# Altium schematic sheet STM32F103RBT6.SchDoc
size A4
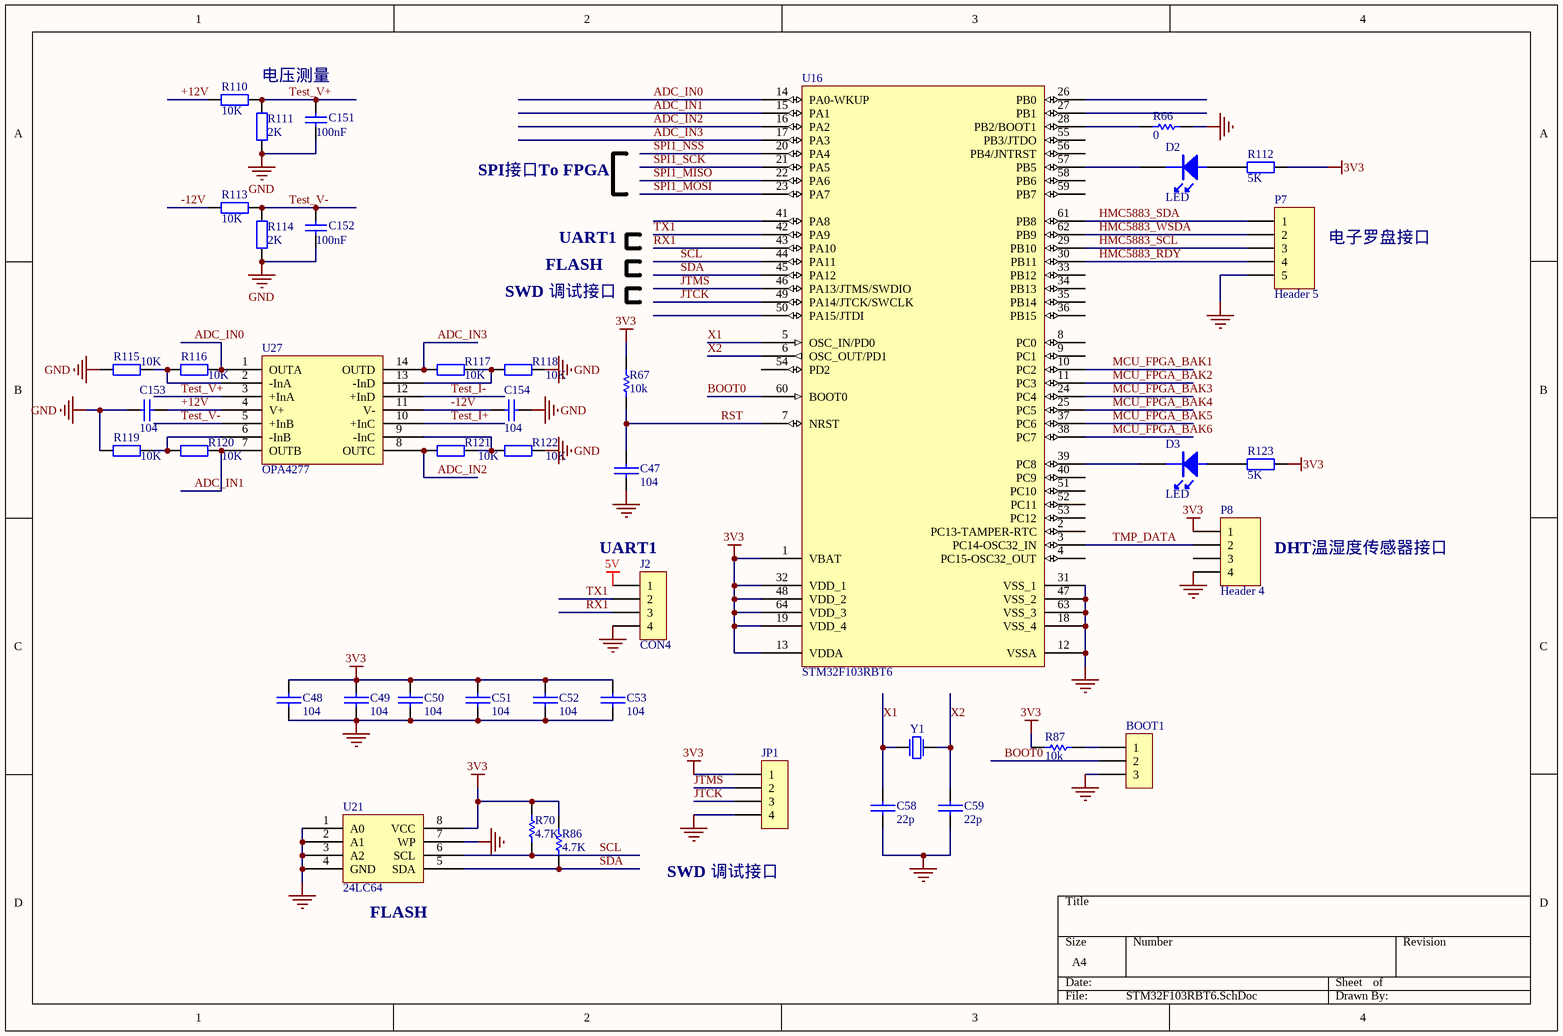
[diagram p0: STM32F103RBT6.SchDoc]

## Parts
BOOT1  (no value)  [HDR1X3]
C47  104  [0603]
C48  104  [0603]
C49  104  [0603]
C50  104  [0603]
C51  104  [0603]
C52  104  [0603]
C53  104  [0603]
C58  22p  [0603]
C59  22p  [0603]
C151  value 100nF  [0603]  (hidden comment: Cap)
C152  value 100nF  [0603]  (hidden comment: Cap)
C153  104  [0603]
C154  104  [0603]
D2  LED  [0805_LED]
D3  LED  [0805_LED]
J2  CON4  [HDR1X4]
JP1  (no value)  [HDR1X4]
P7  Header 5  [HDR1X5]
P8  Header 4  [HDR1X4]
R66  0  [0603]
R67  10k  [0603]
R70  4.7K  [0603]
R86  4.7K  [0603]
R87  10k  [0603]
R110  value 10K  [0603]  (hidden comment: Res2)
R111  value 2K  [0603]  (hidden comment: Res2)
R112  value 5K  [0603]  (hidden comment: Res2)
R113  value 10K  [0603]  (hidden comment: Res2)
R114  value 2K  [0603]  (hidden comment: Res2)
R115  value 10K  [0603]  (hidden comment: Res2)
R116  value 10K  [0603]  (hidden comment: Res2)
R117  value 10K  [0603]  (hidden comment: Res2)
R118  value 10K  [0603]  (hidden comment: Res2)
R119  value 10K  [0603]  (hidden comment: Res2)
R120  value 10K  [0603]  (hidden comment: Res2)
R121  value 10K  [0603]  (hidden comment: Res2)
R122  value 10K  [0603]  (hidden comment: Res2)
R123  value 5K  [0603]  (hidden comment: Res2)
U16  STM32F103RBT6  [LQFP64_M]
U21  24LC64  [SO8]
U27  OPA4277  [SOP14]
Y1  (no value)  [XTAL_8M]

## Nets
3V3: C48.1 C49.1 C50.1 C51.1 C52.1 C53.1 JP1.1 P8.1 R67.2 R70.2 R86.2 R87.1 R112.2 R123.2 U16.1(VBAT) U16.13(VDDA) U16.19(VDD_4) U16.32(VDD_1) U16.48(VDD_2) U16.64(VDD_3) U21.8(VCC)
5V: J2.1
GND: BOOT1.3 C47.2 C48.2 C49.2 C50.2 C51.2 C52.2 C53.2 C58.2 C59.2 C151.1 C152.1 C153.1 C154.2 J2.4 JP1.4 P7.5 P8.4 R66.2 R111.2 R114.2 R115.1 R118.2 R119.1 R122.2 U16.12(VSSA) U16.18(VSS_4) U16.31(VSS_1) U16.47(VSS_2) U16.63(VSS_3) U21.1(A0) U21.2(A1) U21.3(A2) U21.4(GND) U21.7(WP)
+12V: C153.2 R110.2 U27.4(V+)
-12V: C154.1 R113.2 U27.11(V-)
ADC_IN0: R116.2 U16.14(PA0-WKUP) U27.1(OUTA)
ADC_IN1: R120.2 U16.15(PA1) U27.7(OUTB)
ADC_IN2: R121.1 U16.16(PA2) U27.8(OUTC)
ADC_IN3: R117.1 U16.17(PA3) U27.14(OUTD)
BOOT0: BOOT1.2 U16.60(BOOT0)
HMC5883_RDY: P7.4 U16.30(PB11)
HMC5883_SCL: P7.3 U16.29(PB10)
HMC5883_SDA: P7.1 U16.61(PB8)
HMC5883_WSDA: P7.2 U16.62(PB9)
JTCK: JP1.3 U16.49(PA14/JTCK/SWCLK)
JTMS: JP1.2 U16.46(PA13/JTMS/SWDIO)
MCU_FPGA_BAK1: U16.10(PC2)
MCU_FPGA_BAK2: U16.11(PC3)
MCU_FPGA_BAK3: U16.24(PC4)
MCU_FPGA_BAK4: U16.25(PC5)
MCU_FPGA_BAK5: U16.37(PC6)
MCU_FPGA_BAK6: U16.38(PC7)
RST: C47.1 R67.1 U16.7(NRST)
RX1: J2.3 U16.43(PA10)
SCL: R70.1 U16.44(PA11) U21.6(SCL)
SDA: R86.1 U16.45(PA12) U21.5(SDA)
SPI1_MISO: U16.22(PA6)
SPI1_MOSI: U16.23(PA7)
SPI1_NSS: U16.20(PA4)
SPI1_SCK: U16.21(PA5)
Test_I+: U27.10(+InC)
Test_I-: U27.12(+InD)
Test_V+: C151.2 R110.1 R111.1 U27.3(+InA)
Test_V-: C152.2 R113.1 R114.1 U27.5(+InB)
TMP_DATA: P8.2 U16.3(PC14-OSC32_IN)
TX1: J2.2 U16.42(PA9)
X1: C58.1 U16.5(OSC_IN/PD0) Y1.2(P2)
X2: C59.1 U16.6(OSC_OUT/PD1) Y1.1(P1)
NetBOOT1_1: BOOT1.1 R87.2
NetD2_1: D2.1(A) R112.1
NetD2_2: D2.2(K) U16.57(PB5)
NetD3_1: D3.1(A) R123.1
NetD3_2: D3.2(K) U16.39(PC8)
NetR66_1: R66.1 U16.28(PB2/BOOT1)
NetR115_2: R115.2 R116.1 U27.2(-InA)
NetR117_2: R117.2 R118.1 U27.13(-InD)
NetR119_2: R119.2 R120.1 U27.6(-InB)
NetR121_2: R121.2 R122.1 U27.9(-InC)

Not connected (* = marked no-connect by the designer): P8 3; U16 2(PC13-TAMPER-RTC) 4(PC15-OSC32_OUT) 8(PC0) 9(PC1) 26(PB0) 27(PB1) 33(PB12) 34(PB13) 35(PB14) 36(PB15) 40(PC9) 41(PA8) 50(PA15/JTDI) 51(PC10) 52(PC11) 53(PC12) 54(PD2) 55(PB3/JTDO) 56(PB4/JNTRST) 58(PB6) 59(PB7)

## Notes on the sheet
- 电压测量
- SPI接口To FPGA
- UART1
- 电子罗盘接口
- SWD 调试接口
- FLASH
- (near J2) UART1
- DHT温湿度传感器接口
- (near U21) FLASH

## Library data of the parts
BOOT1 = CON3: Connector
C47-C53 C58 C59 = CAP: Capacitor
C151 C152 = Cap: Capacitor; Published: 8-Jun-2000; LatestRevisionDate: 17-Jul-2002; LatestRevisionNote: Re-released for DXP Platform.; PackageReference: RAD-0.3; Publisher: Altium Limited
C153 C154 = Cap: Capacitor; Value: 100nF; Published: 8-Jun-2000; LatestRevisionDate: 17-Jul-2002; LatestRevisionNote: Re-released for DXP Platform.; PackageReference: RAD-0.3; Publisher: Altium Limited
J2 JP1 = CON4: Connector
P7 = Header 5: Header, 5-Pin; LatestRevisionDate: 17-Jul-2002; LatestRevisionNote: Re-released for DXP Platform.; Publisher: Altium Limited
P8 = Header 4: Header, 4-Pin; LatestRevisionDate: 17-Jul-2002; LatestRevisionNote: Re-released for DXP Platform.; Publisher: Altium Limited
R66 R70 R86 = Res1: Resistor; Published: *; Revision: *; Publisher: *; Value: *
R67 R87 = res1: Resistor; Published: *; Revision: *; Publisher: *; Value: *
R110-R123 = Res2: Resistor; Published: 8-Jun-2000; LatestRevisionDate: 17-Jul-2002; LatestRevisionNote: Re-released for DXP Platform.; PackageReference: AXIAL-0.4; Publisher: Altium Limited
U16 = STM32F103RBT6: STM32 ARM-based 32-bit MCU with 128 Kbytes Flash, 64-pin LQFP, Industrial Temperature; Published: *; DatasheetVersion: *; PackageVersion: *; PackageReference: *; Publisher: *; PackageDescription: *; ComponentLink1Description: *; ComponentLink1URL: *; ComponentLink2Description: *; ComponentLink2URL: *
U21 = 24C02
Y1 = XTAL: Crystal Oscillator